# Altium schematic sheet CapacitiveTouch.SchDoc: MSE - CSYEI : TouchPad buttons
size A4; Author: Guillaume Volery; SheetNumber: 8; SheetTotal: 8; SVN: OUI; Version: 2.1; NoProject: <no>; TitleProject: <project>
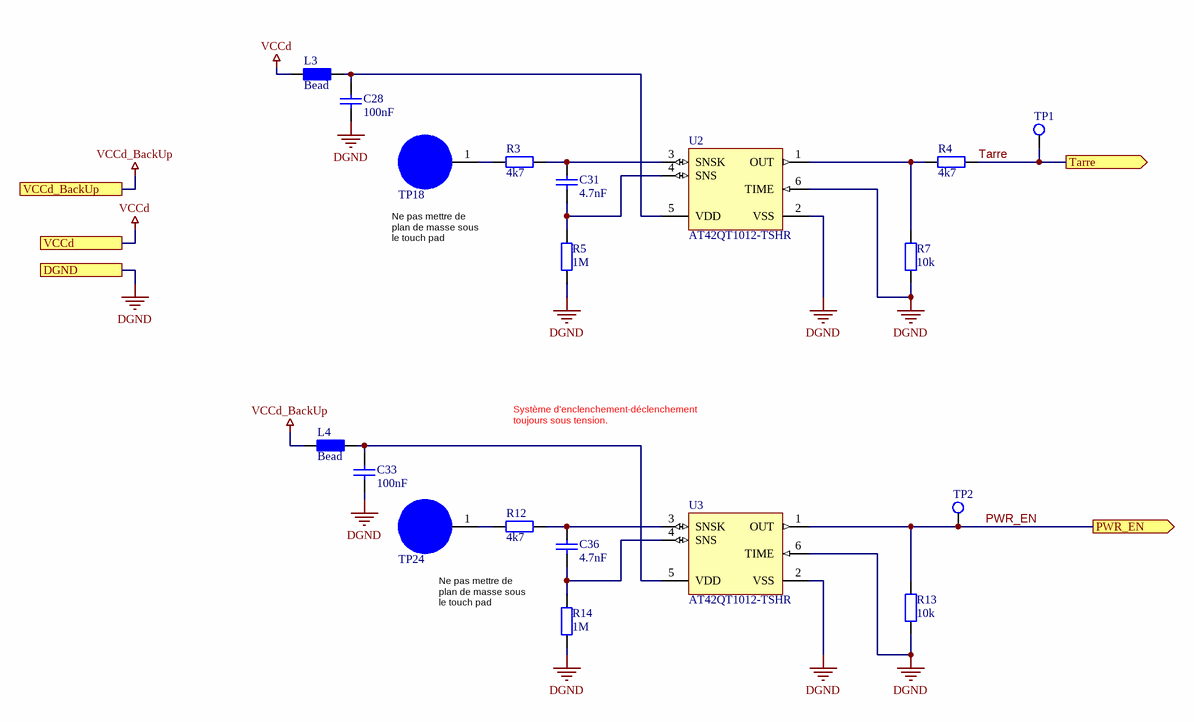
[diagram p0: CapacitiveTouch.SchDoc]

## Parts
C28  100nF  [CAPC2012N]
C31  4.7nF  [CAPC2012N]
C33  100nF  [CAPC2012N]
C36  4.7nF  [CAPC2012N]
L3  Bead  [RESC2012N]
L4  Bead  [RESC2012N]
R3  4k7  [RESC2012N]
R4  4k7  [RESC2012N]
R5  1M  [RESC2012N]
R7  10k  [RESC2012N]
R12  4k7  [RESC2012N]
R13  10k  [RESC2012N]
R14  1M  [RESC2012N]
TP1  TP  [Testpoint]  (value not drawn)
TP2  TP  [Testpoint]  (value not drawn)
TP18  TouchPad10mm  [TouchPad10mm]  (value not drawn)
TP24  TouchPad10mm  [TouchPad10mm]  (value not drawn)
U2  AT42QT1012-TSHR  [SOT-23-6]
U3  AT42QT1012-TSHR  [SOT-23-6]

## Ports
DGND, PWR_EN (out), Tarre (out), VCCd, VCCd_BackUp

## Nets
DGND: C28.1 C33.1 R5.1 R7.1 R13.1 R14.1 U2.2(VSS) U2.6(TIME) U3.2(VSS) U3.6(TIME) ; port DGND
VCCd: L3.1 ; port VCCd
VCCd_BackUp: L4.1 ; port VCCd_BackUp
PWR_EN: R13.2 TP2.1 U3.1(OUT) ; port PWR_EN
Tarre: R4.2 TP1.1 ; port Tarre
NetC28_2: C28.2 L3.2 U2.5(VDD)
NetC31_1: C31.1 R5.2 U2.4(SNS)
NetC31_2: C31.2 R3.2 U2.3(SNSK)
NetC33_2: C33.2 L4.2 U3.5(VDD)
NetC36_1: C36.1 R14.2 U3.4(SNS)
NetC36_2: C36.2 R12.2 U3.3(SNSK)
NetR3_1: R3.1 TP18.1
NetR4_1: R4.1 R7.2 U2.1(OUT)
NetR12_1: R12.1 TP24.1

## Notes on the sheet
- Ne pas mettre de
  plan de masse sous
  le touch pad
- Système d'enclenchement-déclenchement
  toujours sous tension.
- Title
- Institut d'automatisation industrielle
  rte de Cheseaux 1
  CH-1401 Yverdon-les-Bains
  T +41(0)24 55 77 377    F +41(0)24 55 76 320
  http://iai.heig-vd.ch       iai@heig-vd.ch
- Date:
- Size:
- A4
- Project:
- Sheet
- of
- No.
- Author:
- SVN
- Version
- File:

## Library data of the parts
C28 C33 = Cap_100nF: Capacitor; Value: 100nF; Supplier 1: Digi-Key; Supplier Part Number 1: 478-1395-1-ND
C31 C36 = Cap_4.7nF: Capacitor; Value: 4.7nF; Supplier 1: Digi-Key; Supplier Part Number 1: 311-1431-1-ND
R3 R4 R12 = Res_4k7: Resistor; Value: 4k7; Supplier 1: Digi-Key; Supplier Part Number 1: 311-4.70KCRCT-ND
R5 R14 = Res_1M: Resistor; Value: 1M; Supplier 1: Digi-Key; Supplier Part Number 1: 311-1.00MCRCT-ND
R7 R13 = Res_10k: Resistor; Value: 10k; Supplier 1: Digi-Key; Supplier Part Number 1: 311-10.0KCRCT-ND
TP1 TP2 = TP: =Value; Supplier 1: Digi-Key; Supplier Part Number 1: 36-5006-ND
U2 U3 = AT42QT1012-TSHR: One-channel Toggle-mode Touch Sensor IC with Power Management Functions, -40° to +85° C, 6-pin SOT23; DatasheetVersion: revD, Aug-2010; PackageVersion: revA, Jun-2008; PackageReference: 6ST1; PackageDescription: 6-Lead, 2.90 x 1.60 mm Plastic Small Outline Package (SOT23); Code_JEDEC: MO-178-AB; Code_IPC: SOT26A-6; ComponentLink1Description: Manufacturer URL; ComponentLink1URL: http://www.atmel.com/; ComponentLink2Description: Datasheet; ComponentLink2URL: http://www.atmel.com/Images/doc9543.pdf; Supplier 1: Digi-Key; Supplier Part Number 1: AT42QT1012-TSHRCT-ND
L3 L4 = Bead: Value: Bead; Supplier 1: Digi-Key; Supplier Part Number 1: 240-2399-1-ND